# EAGLE schematic template (EAGLE 7.6.0)
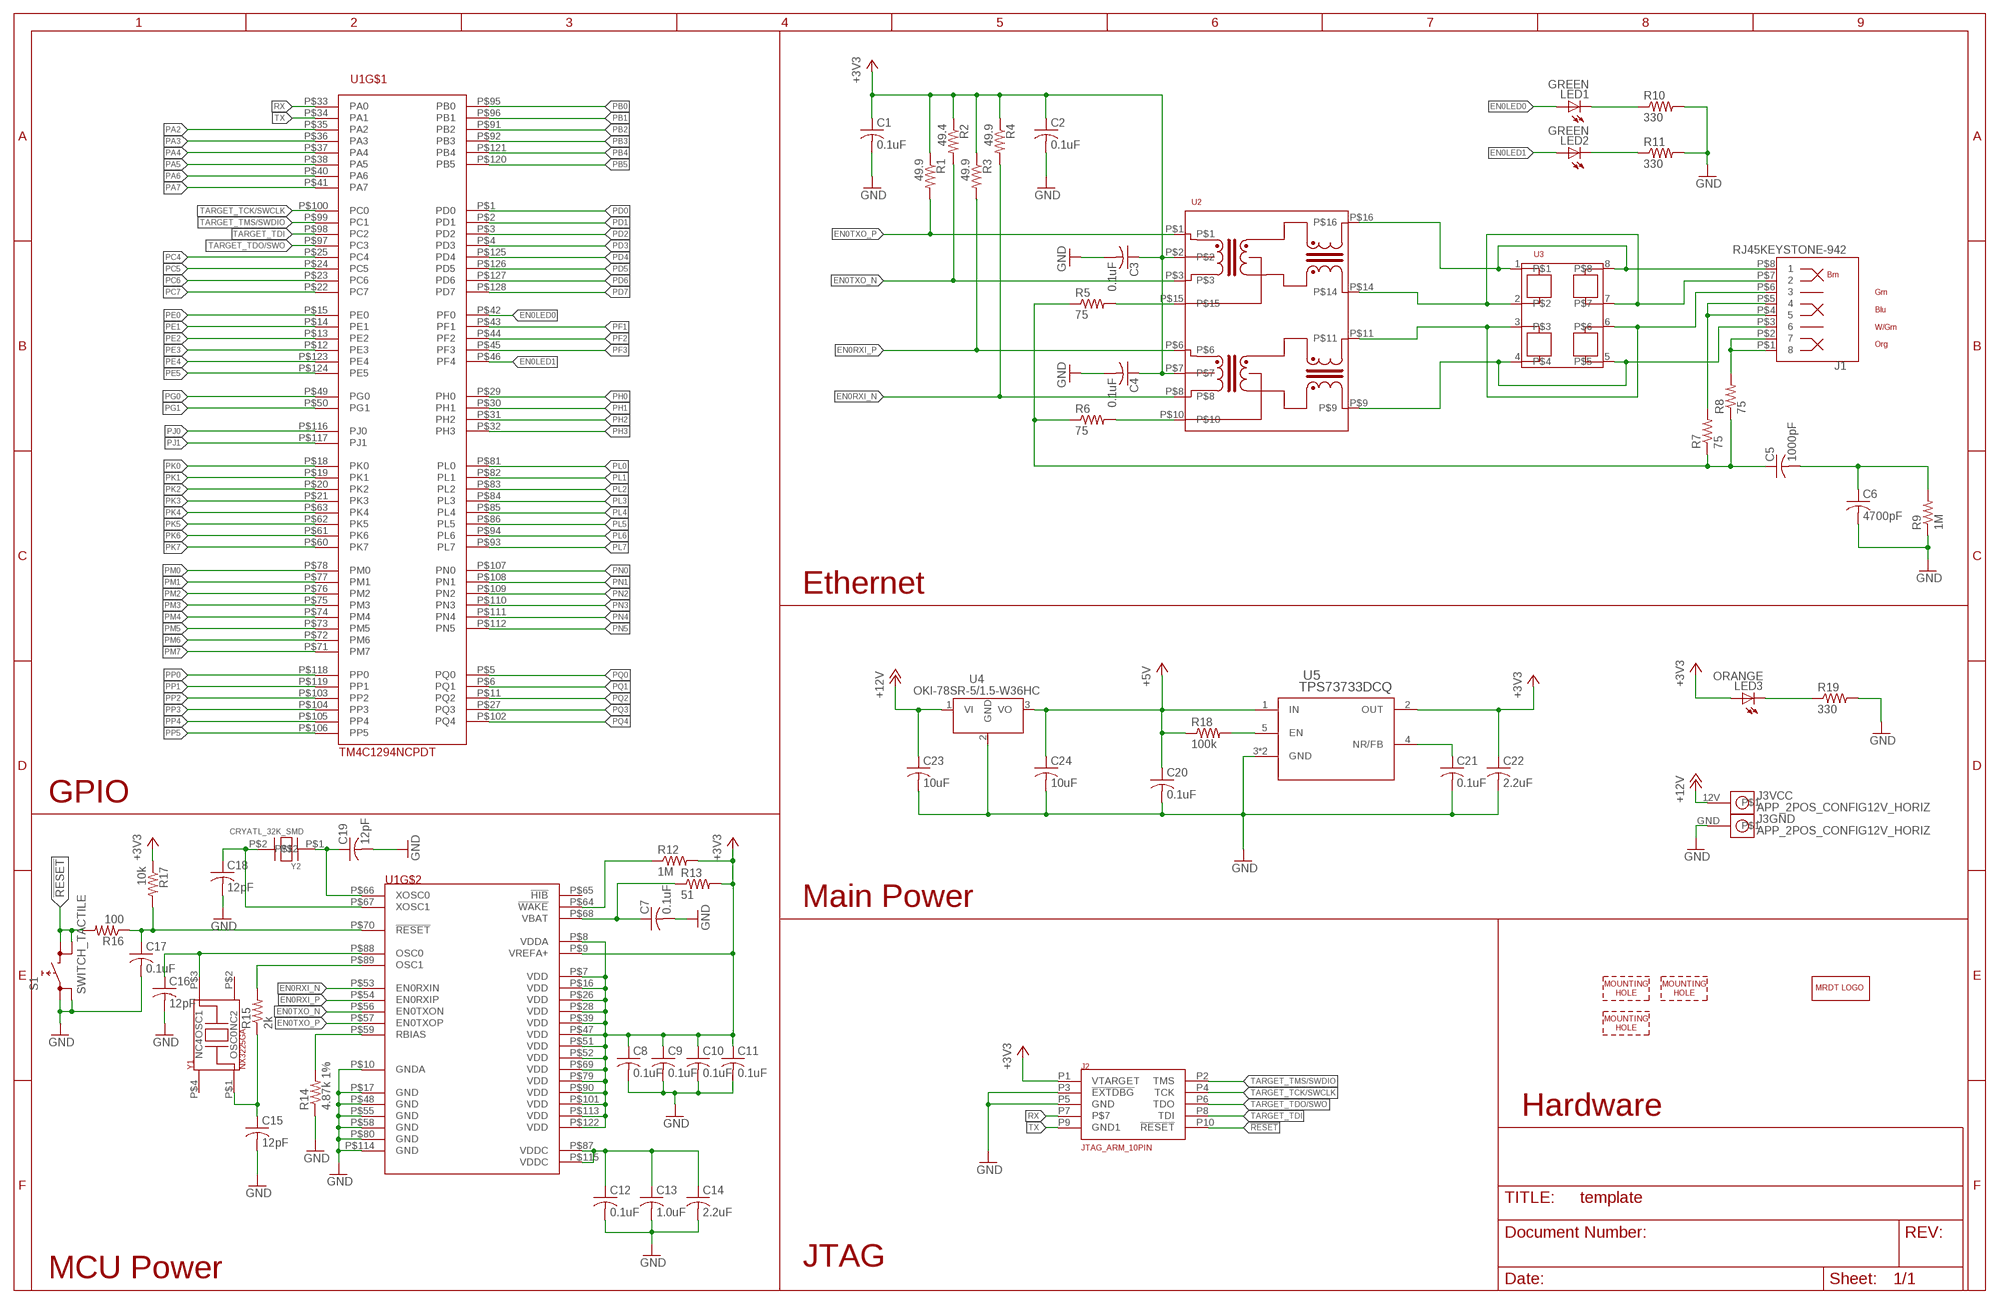
[diagram p0: schematic, sheet 1]

## Parts
C1  0.1uF  C-USC0603  [C0603]
C2  0.1uF  C-USC0603  [C0603]
C3  0.1uF  C-USC0603  [C0603]
C4  0.1uF  C-USC0603  [C0603]
C5  1000pF  C-USC0603  [C0603]
C6  4700pF  C-USC1206  [C1206]
C7  0.1uF  C-USC0603  [C0603]
C8  0.1uF  C-USC0603  [C0603]
C9  0.1uF  C-USC0603  [C0603]
C10  0.1uF  C-USC0603  [C0603]
C11  0.1uF  C-USC0603  [C0603]
C12  0.1uF  C-USC0603  [C0603]
C13  1.0uF  C-USC0603  [C0603]
C14  2.2uF  C-USC0603  [C0603]
C15  12pF  C-USC0603  [C0603]
C16  12pF  C-USC0603  [C0603]
C17  0.1uF  C-USC0603  [C0603]
C18  12pF  C-USC0603  [C0603]
C19  12pF  C-USC0603  [C0603]
C20  0.1uF  C-USC0603  [C0603]
C21  0.1uF  C-USC0603  [C0603]
C22  2.2uF  C-USC0603  [C0603]
C23  10uF  C-USC0603  [C0603]
C24  10uF  C-USC0603  [C0603]
J1  RJ45KEYSTONE-942  [KEYSTONE-942]
J2  JTAG_ARM_10PIN  [CON_2X5_50MIL]
J3  APP_2POS_CONFIG12V_HORIZ  [APP45_12V_HORIZ_CONFIG]
LED1  GREEN  LEDCHIP-LED0603  [CHIP-LED0603]
LED2  GREEN  LEDCHIP-LED0603  [CHIP-LED0603]
LED3  ORANGE  LEDCHIP-LED0603  [CHIP-LED0603]
R1  49.9  R-US_R0603  [R0603]
R2  49.4  R-US_R0603  [R0603]
R3  49.9  R-US_R0603  [R0603]
R4  49.9  R-US_R0603  [R0603]
R5  75  R-US_R0603  [R0603]
R6  75  R-US_R0603  [R0603]
R7  75  R-US_R0603  [R0603]
R8  75  R-US_R0603  [R0603]
R9  1M  R-US_R1206  [R1206]
R10  330  R-US_R0603  [R0603]
R11  330  R-US_R0603  [R0603]
R12  1M  R-US_R0603  [R0603]
R13  51  R-US_R0603  [R0603]
R14  4.87k 1%  R-US_R0603  [R0603]
R15  2k  R-US_R0603  [R0603]
R16  100  R-US_R0603  [R0603]
R17  10k  R-US_R0603  [R0603]
R18  100k  R-US_R0603  [R0603]
R19  330  R-US_R0603  [R0603]
S1  SWITCH_TACTILE  [SWITCH_6MM_6MM_TE_CON_SMD]
U1  TM4C1294NCPDT  [TQFP-128]
U2  HX1198FNL  [HX1198FNL]
U3  SLVU2.8-4  [SOIC8]
U4  OKI-78SR-5/1.5-W36HC  [OKI-78SR_HORIZ]
U5  TPS73733DCQ  [SOT-223-6]
U$1  MRDT_LOGO  [MRDT_LOGO]
U$2  MOUNTING_HOLE#6  [#6_SCREW]
U$3  MOUNTING_HOLE#6  [#6_SCREW]
U$4  MOUNTING_HOLE#6  [#6_SCREW]
Y1  NX3225GA  [NDK3.2X2.5]
Y2  CRYATL_32K_SMD  [CRYSTAL_32K_SMD]

## Nets
!RESET: J2.P10(!RESET) R16.2 S1.P$3 S1.P$4
+3V3: C1.1 C2.1 C3.1 C4.1 C8.1 C9.1 C10.1 C11.1 C22.1 J2.P1(VTARGET) LED3.A R1.1 R2.1 R3.1 R4.1 R12.2 R13.2 R17.1 U1.P$7(VDD) U1.P$8(VDDA) U1.P$9(VREFA+) U1.P$16(VDD) U1.P$26(VDD) U1.P$28(VDD) U1.P$39(VDD) U1.P$47(VDD) U1.P$51(VDD) U1.P$52(VDD) U1.P$69(VDD) U1.P$79(VDD) U1.P$90(VDD) U1.P$101(VDD) U1.P$113(VDD) U1.P$122(VDD) U2.P$2 U2.P$7 U5.2(OUT)
+5V: C20.1 C24.1 R18.1 U4.3(VO) U5.1(IN)
+12V: C23.1 J3.12V U4.1(VI)
EN0LED0: LED1.A U1.P$42(PF0)
EN0LED1: LED2.A U1.P$46(PF4)
EN0RXI_N [Ethernet]: R4.2 U1.P$53(EN0RXIN) U2.P$8
EN0RXI_P [Ethernet]: R3.2 U1.P$54(EN0RXIP) U2.P$6
EN0TXO_N [Ethernet]: R2.2 U1.P$56(EN0TXON) U2.P$3
EN0TXO_P [Ethernet]: R1.2 U1.P$57(EN0TXOP) U2.P$1
GND: C1.2 C2.2 C3.2 C4.2 C6.2 C7.2 C8.2 C9.2 C10.2 C11.2 C12.2 C13.2 C14.2 C15.2 C16.2 C17.2 C18.2 C19.2 C20.2 C21.2 C22.2 C23.2 C24.2 J2.P3(!EXTDBG) J2.P5(GND) J3.GND R9.1 R10.2 R11.2 R14.1 R19.2 S1.P$1 S1.P$2 U1.P$10(GNDA) U1.P$17(GND) U1.P$48(GND) U1.P$55(GND) U1.P$58(GND) U1.P$80(GND) U1.P$114(GND) U4.2(GND) U5.3(GND) U5.6(GND)
N_$1: R5.2 U2.P$15
N_$3: R6.2 U2.P$10
N_$4: J1.P$7 U2.P$14 U3.2 U3.7
N_$5: J1.P$6 U2.P$11 U3.3 U3.6
N_$6: J1.P$8 U2.P$16 U3.1 U3.8
N_$7: J1.P$3 U2.P$9 U3.4 U3.5
N_$8: LED2.C R11.1
N_$9: LED1.C R10.1
N_$10: C7.1 R13.1 U1.P$68(VBAT)
N_$11: J1.P$4 J1.P$5 R7.2
N_$12: R12.1 U1.P$64(!WAKE)
N_$13: J1.P$1 J1.P$2 R8.2
N_$14: C5.1 R5.1 R6.1 R7.1 R8.1
N_$15: C5.2 C6.1 R9.2
N_$16: C12.1 C13.1 C14.1 U1.P$87(VDDC) U1.P$115(VDDC)
N_$17: R15.2 U1.P$89(OSC1)
N_$18: C16.1 U1.P$88(OSC0) Y1.P$3(OSC1)
N_$19: R14.2 U1.P$59(RBIAS)
N_$20: C17.1 R16.1 R17.2 U1.P$70(!RESET)
N_$21: C15.1 R15.1 Y1.P$1(OSC0)
N_$22: C18.1 U1.P$67(XOSC1) Y2.P$2
N_$23: C19.1 U1.P$66(XOSC0) Y2.P$1
N_$25: R18.2 U5.5(EN)
N_$26: LED3.C R19.1
N_$27: C21.1 U5.4(NR/FB)
PA2: U1.P$35(PA2)
PA3: U1.P$36(PA3)
PA4: U1.P$37(PA4)
PA5: U1.P$38(PA5)
PA6: U1.P$40(PA6)
PA7: U1.P$41(PA7)
PB0: U1.P$95(PB0)
PB1: U1.P$96(PB1)
PB2: U1.P$91(PB2)
PB3: U1.P$92(PB3)
PB4: U1.P$121(PB4)
PB5: U1.P$120(PB5)
PC4: U1.P$25(PC4)
PC5: U1.P$24(PC5)
PC6: U1.P$23(PC6)
PC7: U1.P$22(PC7)
PD0: U1.P$1(PD0)
PD1: U1.P$2(PD1)
PD2: U1.P$3(PD2)
PD3: U1.P$4(PD3)
PD4: U1.P$125(PD4)
PD5: U1.P$126(PD5)
PD6: U1.P$127(PD6)
PD7: U1.P$128(PD7)
PE0: U1.P$15(PE0)
PE1: U1.P$14(PE1)
PE2: U1.P$13(PE2)
PE3: U1.P$12(PE3)
PE4: U1.P$123(PE4)
PE5: U1.P$124(PE5)
PF1: U1.P$43(PF1)
PF2: U1.P$44(PF2)
PF3: U1.P$45(PF3)
PG0: U1.P$49(PG0)
PG1: U1.P$50(PG1)
PH0: U1.P$29(PH0)
PH1: U1.P$30(PH1)
PH2: U1.P$31(PH2)
PH3: U1.P$32(PH3)
PJ0: U1.P$116(PJ0)
PJ1: U1.P$117(PJ1)
PK0: U1.P$18(PK0)
PK1: U1.P$19(PK1)
PK2: U1.P$20(PK2)
PK3: U1.P$21(PK3)
PK4: U1.P$63(PK4)
PK5: U1.P$62(PK5)
PK6: U1.P$61(PK6)
PK7: U1.P$60(PK7)
PL0: U1.P$81(PL0)
PL1: U1.P$82(PL1)
PL2: U1.P$83(PL2)
PL3: U1.P$84(PL3)
PL4: U1.P$85(PL4)
PL5: U1.P$86(PL5)
PL6: U1.P$94(PL6)
PL7: U1.P$93(PL7)
PM0: U1.P$78(PM0)
PM1: U1.P$77(PM1)
PM2: U1.P$76(PM2)
PM3: U1.P$75(PM3)
PM4: U1.P$74(PM4)
PM5: U1.P$73(PM5)
PM6: U1.P$72(PM6)
PM7: U1.P$71(PM7)
PN0: U1.P$107(PN0)
PN1: U1.P$108(PN1)
PN2: U1.P$109(PN2)
PN3: U1.P$110(PN3)
PN4: U1.P$111(PN4)
PN5: U1.P$112(PN5)
PP0: U1.P$118(PP0)
PP1: U1.P$119(PP1)
PP2: U1.P$103(PP2)
PP3: U1.P$104(PP3)
PP4: U1.P$105(PP4)
PP5: U1.P$106(PP5)
PQ0: U1.P$5(PQ0)
PQ1: U1.P$6(PQ1)
PQ2: U1.P$11(PQ2)
PQ3: U1.P$27(PQ3)
PQ4: U1.P$102(PQ4)
RX: J2.P7 U1.P$33(PA0)
TARGET_TCK/SWCLK: J2.P4(TCK) U1.P$100(PC0)
TARGET_TDI: J2.P8(TDI) U1.P$98(PC2)
TARGET_TDO/SWO: J2.P6(TDO) U1.P$97(PC3)
TARGET_TMS/SWDIO: J2.P2(TMS) U1.P$99(PC1)
TX: J2.P9(GND1) U1.P$34(PA1)
Unconnected: U1.P$65(!HIB) Y1.P$2(NC2) Y1.P$4(NC4)

## Notes on the sheet
- Ethernet
- GPIO
- Main Power
- Hardware
- JTAG
- MCU Power

## Library data of the parts
C1-C24 = resistor:C-US: CAPACITOR, American symbol
J1 = MRDT-Connectors:RJ45
J2 = MRDT-Connectors:JTAG_ARM_10PIN; PARTNO: M50-3600542
J3 = MRDT-Connectors:APP_2POS_CONFIG; COLOR1: YELLOW; COLOR2: BLACK
LED1-LED3 = led:LED: LED OSRAM: - CHIPLED LG R971, LG N971, LY N971, LG Q971, LY Q971, LO R971, LY R971 LH N974, LH R974 LS Q976, LO Q976, LY Q976 LO Q996 - Hyper CHIPLED LW Q18S LB Q993, LB Q99A, LB R99A - SideLED LS A670, LO A670, LY A670, LG A670, LP A670 LB A673, LV A673, LT A673, LW A673 LH A674 LY A675 LS A676, LA A676, LO A676, LY A676, LW A676 LS A679, LY A679, LG A679 - Hyper Micro SIDELED® LS Y876, LA Y876, LO Y876, LY Y876 LT Y87S - SmartLED LW L88C, LW L88S LB L89C, LB L89S, LG L890 LS L89K, LO L89K, LY L89K LS L896, LA L896, LO L896, LY L896 - TOPLED LS T670, LO T670, LY T670, LG T670, LP T670 LSG T670, LSP T670, LSY T670, LOP T670, LYG T670 LG T671, LOG T671, LSG T671 LB T673, LV T673, LT T673, LW T673 LH T674 LS T676, LA T676, LO T676, LY T676, LB T676, LH T676, LSB T676, LW T676 LB T67C, LV T67C, LT T67C, LS T67K, LO T67K, LY T67K, LW E67C LS E67B, LA E67B, LO E67B, LY E67B, LB E67C, LV E67C, LT E67C LW T67C LS T679, LY T679, LG T679 LS T770, LO T770, LY T770, LG T770, LP T770 LB T773, LV T773, LT T773, LW T773 LH T774 LS E675, LA E675, LY E675, LS T675 LS T776, LA T776, LO T776, LY T776, LB T776 LHGB T686 LT T68C, LB T68C - Hyper Mini TOPLED® LB M676 - Mini TOPLED Santana® LG M470 LS M47K, LO M47K, LY M47K Source: http://www.osram.convergy.de LUXEON: - LUMILED® LXK2-PW12-R00, LXK2-PW12-S00, LXK2-PW14-U00, LXK2-PW14-V00 LXK2-PM12-R00, LXK2-PM12-S00, LXK2-PM14-U00 LXK2-PE12-Q00, LXK2-PE12-R00, LXK2-PE12-S00, LXK2-PE14-T00, LXK2-PE14-U00 LXK2-PB12-K00, LXK2-PB12-L00, LXK2-PB12-M00, LXK2-PB14-N00, LXK2-PB14-P00, LXK2-PB14-Q00 LXK2-PR12-L00, LXK2-PR12-M00, LXK2-PR14-Q00, LXK2-PR14-R00 LXK2-PD12-Q00, LXK2-PD12-R00, LXK2-PD12-S00 LXK2-PH12-R00, LXK2-PH12-S00 LXK2-PL12-P00, LXK2-PL12-Q00, LXK2-PL12-R00 Source: www.luxeon.com KINGBRIGHT: KA-3528ASYC Source: www.kingbright.com
R1 = rcl:R-US_: RESISTOR, American symbol
R2-R19 = resistor:R-US_: RESISTOR, American symbol
S1 = MRDT-UserInput:SWITCH_TACTILE
U1 = MRDT-Microcontrollers:TM4C1294NCPDT
U2 = MRDT-ICs:HX1198FNL
U3 = MRDT-ICs:SLVU2.8-4
U4 = MRDT-ICs:OKI-78SR-*/1.5-W36?C: 4.95W DC/DC Converter Manufacturer: Murata; VOUT: +5v
U5 = MRDT-ICs:TPS73733*: LDO with Reverse Current Protection
U$1 = MRDT-Hardware:MRDT_LOGO
U$2-U$4 = MRDT-Hardware:MOUNTING_HOLE: Mounting hole for M6 bolt. Standard use mounting hole for: Tiva C Connected - M6 Anderson Powerpole Mounting Wing - M8 Most frame-mounted PCB's - M8
Y1 = MRDT-Passives:NX3225GA
Y2 = MRDT-Passives:CRYATL_32K_SMD

## Net classes
2 Ethernet: width 0.22 mm, clearance 0.152 mm